# Altium schematic sheet SP26_FindingTitan_Blanking&Pre_Amp_Michael_Krueger.SchDoc
size A; SheetNumber: 4; SheetTotal: 6
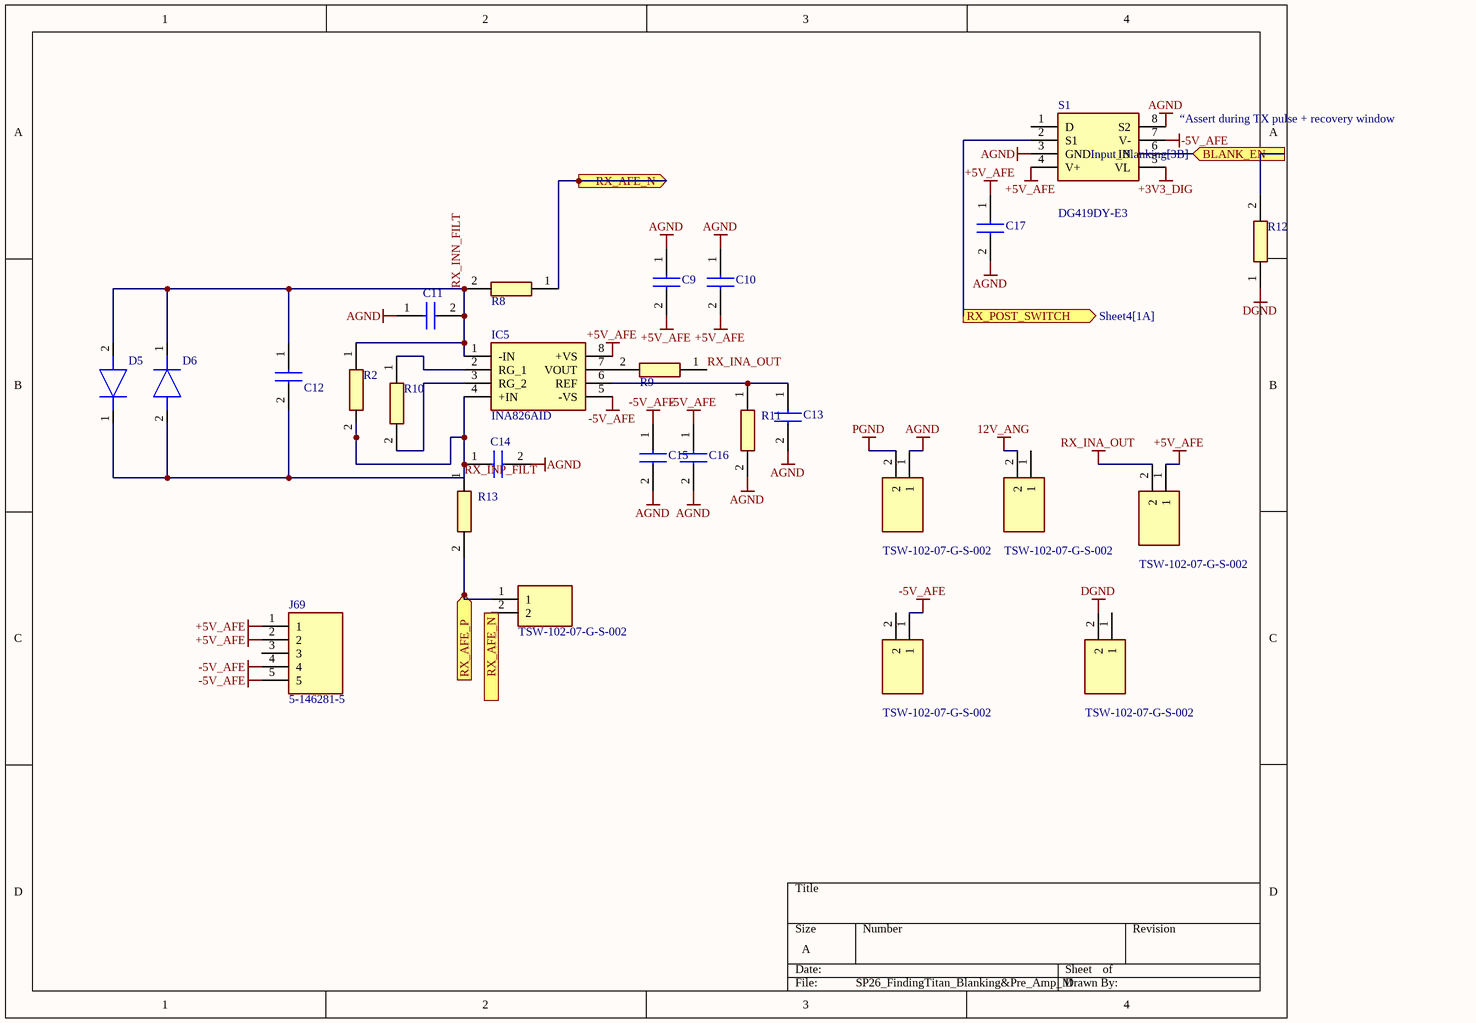
[diagram p0: SP26_FindingTitan_Blanking&Pre_Amp_Michael_Krueger.SchDoc]

## Parts
(Parts that share a designator on the sheet are numbered #1, #2 ... from top to bottom, then left to right.)
C9  GRM188R71H104KA93B  [CAPC1608X90N]  (value not drawn)
C10  GRM188F51C105ZA01D  [CAPC1608X90N]  (value not drawn)
C11  GRM1885C1H221JA01D  [CAPC1608X90N]  (value not drawn)
C12  GRM1885C1H331JA01D  [CAPC1608X90N]  (value not drawn)
C13  GRM188F51C105ZA01D  [CAPC1608X90N]  (value not drawn)
C14  GRM1885C1H221JA01D  [CAPC1608X90N]  (value not drawn)
C15  GRM188R71H104KA93B  [CAPC1608X90N]  (value not drawn)
C16  GRM188F51C105ZA01D  [CAPC1608X90N]  (value not drawn)
C17  GRM188R71H104KA93B  [CAPC1608X90N]  (value not drawn)
D5  BAS316,H3F  [SOD2513X115N]  (value not drawn)
D6  BAS316,H3F  [SOD2513X115N]  (value not drawn)
IC5  INA826AID  [SOIC127P600X175-8N]
J35  TSW-102-07-G-S-002  [HDRV2W64P0X254_1X2_508X254X838P]
J69  5-146281-5  [HDRV5W67P0X254_1X5_1229X234X821P]
J?#1  TSW-102-07-G-S-002  [HDRV2W64P0X254_1X2_508X254X838P]
J?#2  TSW-102-07-G-S-002  [HDRV2W64P0X254_1X2_508X254X838P]
J?#3  TSW-102-07-G-S-002  [HDRV2W64P0X254_1X2_508X254X838P]
J?#4  TSW-102-07-G-S-002  [HDRV2W64P0X254_1X2_508X254X838P]
J?#5  TSW-102-07-G-S-002  [HDRV2W64P0X254_1X2_508X254X838P]
R2  1 or 4k  [RESC2013X65N]  (value not drawn)
R8  CRCW0603100RFKEAHP  [RESC1608X50N]  (value not drawn)
R9  CRCW0603100RFKEAHP  [RESC1608X50N]  (value not drawn)
R10  TNPW08052K49BEEA  [RESC2013X65N]  (value not drawn)
R11  CRCW0603100RFKEAHP  [RESC1608X50N]  (value not drawn)
R12  TNPW0805100KBEEA  [RESC2012X55N]  (value not drawn)
R13  CRCW0603100RFKEAHP  [RESC1608X50N]  (value not drawn)
S1  DG419DY-E3  [SOIC127P600X175-8N]

## Ports
BLANK_EN (in, see Input_Blanking[3B]), RX_AFE_N (in, see Sheet2[2A]), RX_AFE_N (in, see Sheet2[2C]), RX_AFE_P (in), RX_POST_SWITCH (out, see Sheet4[1A])

## Nets
12V_ANG: J?#2.2
+3V3_DIG: S1.5(VL)
+5V_AFE: C9.2 C10.2 C17.1 IC5.8(+VS) J69.1 J69.2 J?#3.1 S1.4(V+)
-5V_AFE: C15.1 C16.1 IC5.5(-VS) J69.4 J69.5 J?#5.1 S1.7(V-)
AGND: C9.1 C10.1 C11.1 C13.2 C14.2 C15.2 C16.2 C17.2 J?#1.1 R11.2 S1.3(GND) S1.8(S2)
DGND: J35.2 R12.1
PGND: J?#1.2
RX_INA_OUT: J?#3.2 R9.1
BLANK_EN: R12.2 S1.6(IN) ; port BLANK_EN
RX_AFE_N: J?#4.2 R8.1 ; port RX_AFE_N
RX_AFE_P: J?#4.1 R13.2 ; port RX_AFE_P
RX_INN_FILT: C11.2 C12.1 D5.2(A) D6.1(K) IC5.1(-IN) R2.1 R8.2
RX_INP_FILT: C12.2 C14.1 D5.1(K) D6.2(A) IC5.4(+IN) R2.2 R13.1
RX_POST_SWITCH: S1.2(S1) ; port RX_POST_SWITCH
NetC13_1: C13.1 IC5.6(REF) R11.1
NetIC5_2: IC5.2(RG_1) R10.1
NetIC5_3: IC5.3(RG_2) R10.2
NetIC5_7: IC5.7(VOUT) R9.2

Not connected (* = marked no-connect by the designer): J35 1; J69 3; J?#2 1; J?#5 2; S1 1(D)

## Notes on the sheet
- (near S1) “Assert during TX pulse + recovery window

## Library data of the parts
C9 C15 C17 = GRM188R71H104KA93B: Capacitor; Manufacturer_Name: Murata Electronics; Datasheet Link: http://componentsearchengine.com/Datasheets/1/GRM188R71H104KA93B.pdf; Height: 0.9mm; Manufacturer_Part_Number: GRM188R71H104KA93B; Mouser Part Number: N/A; Mouser Price/Stock: https://www.mouser.co.uk/ProductDetail/Murata-Electronics/GRM188R71H104KA93B?qs=UOvNgVTuGCrHGVnSgRWyLQ%3D%3D
C10 C13 C16 = GRM188F51C105ZA01D: Capacitor; Manufacturer_Name: Murata Electronics; Datasheet Link: https://datasheet.datasheetarchive.com/originals/distributors/Datasheets_SAMA/2efa66a080e3cf3c6ed43516475c2c90.pdf; Height: 0.9mm; Manufacturer_Part_Number: GRM188F51C105ZA01D; Mouser Part Number: 81-GRM188F51C105ZA01; Mouser Price/Stock: https://www.mouser.com/Search/Refine.aspx?Keyword=81-GRM188F51C105ZA01
C11 C14 = GRM1885C1H221JA01D: Capacitor; Manufacturer_Name: Murata Electronics; Datasheet Link: https://search.murata.co.jp/Ceramy/image/img/A01X/G101/ENG/GRM1885C1H221JA01-01A.pdf; Height: 0.9mm; Manufacturer_Part_Number: GRM1885C1H221JA01D; Mouser Part Number: 81-GRM39C221J050; Mouser Price/Stock: https://www.mouser.co.uk/ProductDetail/Murata-Electronics/GRM1885C1H221JA01D?qs=wkTplMQEP5E5DEUKvrPh1w%3D%3D; Arrow Part Number: GRM1885C1H221JA01D; Arrow Price/Stock: https://www.arrow.com/en/products/grm1885c1h221ja01d/murata-manufacturing?utm_currency=USD&region=europe
C12 = GRM1885C1H331JA01D: Capacitor; Manufacturer_Name: Murata Electronics; Datasheet Link: https://search.murata.co.jp/Ceramy/image/img/A01X/G101/ENG/GRM1885C1H331JA01-01A.pdf; Height: 0.9mm; Manufacturer_Part_Number: GRM1885C1H331JA01D; Mouser Part Number: 81-GRM39C331J50; Mouser Price/Stock: https://www.mouser.co.uk/ProductDetail/Murata-Electronics/GRM1885C1H331JA01D?qs=DiwnqUvG%2FIUYCCwNVhuo3w%3D%3D; Arrow Part Number: GRM1885C1H331JA01D; Arrow Price/Stock: https://www.arrow.com/en/products/grm1885c1h331ja01d/murata-manufacturing?region=nac
D5 D6 = BAS316,H3F: Diode; Manufacturer_Name: Toshiba; Datasheet Link: https://componentsearchengine.com/Datasheets/1/BAS316,H3F.pdf; Height: 1.15mm; Manufacturer_Part_Number: BAS316,H3F; Mouser Part Number: 757-BAS316H3F; Mouser Price/Stock: https://www.mouser.co.uk/ProductDetail/Toshiba/BAS316H3F?qs=BZBei1rCqCAF6ZfkHiRZNg%3D%3D; Arrow Part Number: BAS316,H3F; Arrow Price/Stock: https://www.arrow.com/en/products/bas316h3f/toshiba?region=nac
IC5 = INA826AID: Integrated Circuit; Manufacturer_Name: Texas Instruments; Datasheet Link: http://www.ti.com/lit/gpn/ina826; Height: 1.75mm; Manufacturer_Part_Number: INA826AID; Mouser Part Number: 595-INA826AID; Mouser Price/Stock: https://www.mouser.co.uk/ProductDetail/Texas-Instruments/INA826AID?qs=RqytGdBYyUH0CDtkCzl1iw%3D%3D; Arrow Part Number: INA826AID; Arrow Price/Stock: https://www.arrow.com/en/products/ina826aid/texas-instruments?utm_currency=USD&region=nac
J35 J?#1-J?#5 = TSW-102-07-G-S-002: Connector; Manufacturer_Name: SAMTEC; Datasheet Link: http://suddendocs.samtec.com/prints/tsw-xxx-xx-xxx-x-xx-xxx-mkt.pdf; Height: 8.38mm; Manufacturer_Part_Number: TSW-102-07-G-S-002; Mouser Part Number: 200-TSW-10207GS002; Mouser Price/Stock: https://www.mouser.co.uk/ProductDetail/Samtec/TSW-102-07-G-S-002?qs=icabnvfcbsHvpvHCodBv1Q%3D%3D; Arrow Part Number: TSW-102-07-G-S-002; Arrow Price/Stock: https://www.arrow.com/en/products/tsw-102-07-g-s-002/samtec?utm_currency=USD&region=nac
J69 = 5-146281-5: Connector; Manufacturer_Name: TE Connectivity; Datasheet Link: https://www.te.com/commerce/DocumentDelivery/DDEController?Action=showdoc&DocId=Customer+Drawing%7F146281%7FG2%7Fpdf%7FEnglish%7FENG_CD_146281_G2.pdf%7F5-146281-5; Height: 8.21mm; Manufacturer_Part_Number: 5-146281-5; Mouser Part Number: 571-5-146281-5; Mouser Price/Stock: https://www.mouser.co.uk/ProductDetail/TE-Connectivity/5-146281-5?qs=bwpFY26eRVcDY9brDBVAcw%3D%3D; Arrow Part Number: 5-146281-5; Arrow Price/Stock: https://www.arrow.com/en/products/5-146281-5/te-connectivity?region=nac
R2 R10 = TNPW08052K49BEEA: Resistor; Manufacturer_Name: Vishay; Manufacturer_Part_Number: TNPW08052K49BEEA; Mouser Part Number: 71-TNPW08052K49BEEA; Mouser Price/Stock: https://www.mouser.co.uk/ProductDetail/Vishay-Dale/TNPW08052K49BEEA?qs=hgbOVb73YtjEQoY7WSgC7A%3D%3D
R8 R9 R11 R13 = CRCW0603100RFKEAHP: Resistor; Manufacturer_Name: Vishay; Datasheet Link: http://www.farnell.com/datasheets/1885357.pdf; Height: 0.5mm; Manufacturer_Part_Number: CRCW0603100RFKEAHP; Mouser Part Number: 71-CRCW0603100RFKEAH; Mouser Price/Stock: https://www.mouser.co.uk/ProductDetail/Vishay-Dale/CRCW0603100RFKEAHP?qs=k2%2FDWSARqgFge2%2F4aMqsYg%3D%3D; Arrow Part Number: CRCW0603100RFKEAHP; Arrow Price/Stock: https://www.arrow.com/en/products/crcw0603100rfkeahp/vishay?utm_currency=USD&region=europe
R12 = TNPW0805100KBEEA: Resistor; Manufacturer_Name: Vishay; Datasheet Link: http://www.farnell.com/datasheets/2609085.pdf; Height: 0.55mm; Manufacturer_Part_Number: TNPW0805100KBEEA; Mouser Part Number: 71-TNPW0805100KBEEA; Mouser Price/Stock: https://www.mouser.co.uk/ProductDetail/Vishay-Dale/TNPW0805100KBEEA?qs=CqEPuS5aiX%252B%2Fw%252BT8t4N3Zg%3D%3D; Arrow Part Number: TNPW0805100KBEEA; Arrow Price/Stock: https://www.arrow.com/en/products/tnpw0805100kbeea/vishay?region=nac
S1 = DG419DY-E3: Switch; Manufacturer_Name: Vishay; Datasheet Link: https://componentsearchengine.com/Datasheets/2/DG419DY-E3.pdf; Height: 1.75mm; Manufacturer_Part_Number: DG419DY-E3; Mouser Part Number: 781-DG419DY-E3; Mouser Price/Stock: https://www.mouser.co.uk/ProductDetail/Vishay-Siliconix/DG419DY-E3?qs=cz8xFaX4kJI2MgO6wGiioA%3D%3D; Arrow Part Number: DG419DY-E3; Arrow Price/Stock: https://www.arrow.com/en/products/dg419dy-e3/vishay?region=nac